# EAGLE design pixel-mk-1.0 (EAGLE 6.5.0)
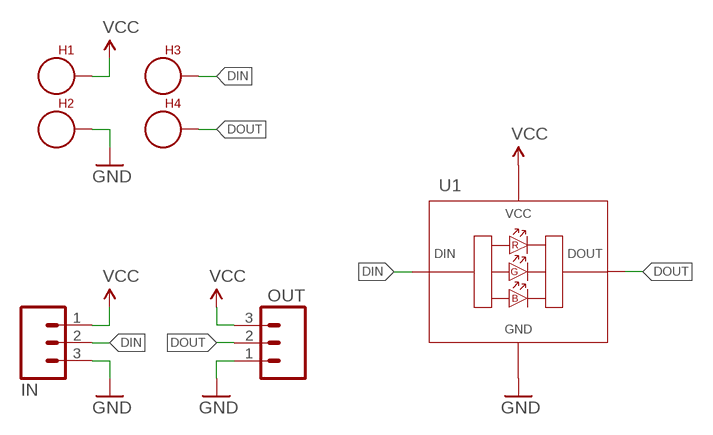
[diagram p0: schematic, sheet 1]

## Parts
H1  SEW_HOLE  [SIMPLE_HOLE]
H2  SEW_HOLE  [SIMPLE_HOLE]
H3  SEW_HOLE  [SIMPLE_HOLE]
H4  SEW_HOLE  [SIMPLE_HOLE]
IN  M03JST-PTH  [JST-3-PH-RA-PTH]
OUT  M03JST-PTH  [JST-3-PH-RA-PTH]
U1  NEOPIXEL5MM-PTH-RA-NS  [LED-5MM-PTH-FUCK-RA-NS]

## Nets
DIN: H3.P$1 IN.2 U1.1(DIN)
DOUT: H4.P$1 OUT.2 U1.4(DOUT)
GND: H2.P$1 IN.3 OUT.1 U1.3(GND)
VCC: H1.P$1 IN.1 OUT.3 U1.2(VCC)

## Library data of the parts
H1-H4 = A_butts:SEW_HOLE: Simple sew-hole .1" diameter hole with 20mil annular ring
IN OUT = A_butts:M03: Header 3 Standard 3-pin 0.1" header. Use with straight break away headers (SKU : PRT-00116), right angle break away headers (PRT-00553), swiss pins (PRT-00743), machine pins (PRT-00117), and female headers (PRT-00115). Molex polarized connector foot print use with SKU : PRT-08232 with associated crimp pins and housings.; SKU: PRT-09915
U1 = A_butts:NEOPIXEL

## Board
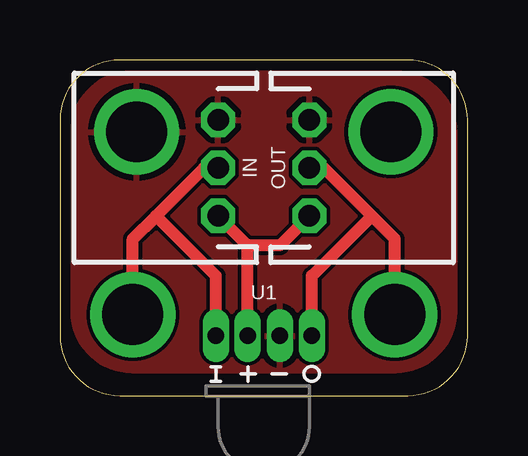
[diagram p1: board, top side]
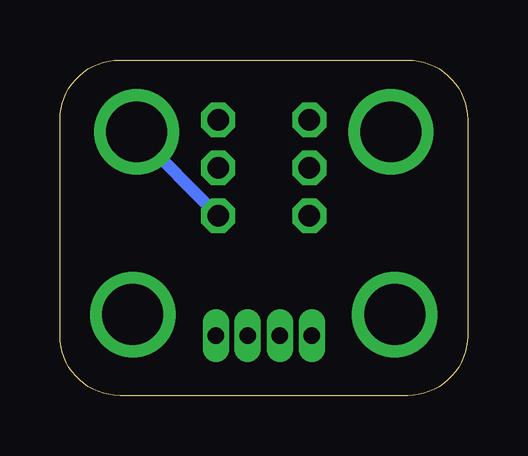
[diagram p2: board, bottom side, seen from below]

Size 17 x 14 mm. Coordinates in mm from the lower left corner, seen from the top.
Outline: 0,11.5 0,2.5 arc90 2.5,0 14.5,0 arc90 17,2.5 17,11.5 arc90 14.5,14 2.5,14 arc90 0,11.5
Copper layers (1*16): Top 0.0356mm / dielectric 1.5011mm / Bottom 0.0356mm
Design rules "LaenPCBOrder_2": minimum track width 6mil, minimum drill 13mil, track to track 6mil, track to pad 6mil, pad to pad 6mil, via to via 6mil, smd to smd 6mil, copper to edge 15mil, drill to drill 6mil, minimum pad ring 7mil, minimum via ring 7mil, stop-mask expansion 3mil, vias tented up to drill 20mil, thermal gap 10mil

### Footprints (pad centres in the part's own frame; a part is rotated, then mirrored left to right if it is on the bottom)
SIMPLE_HOLE = drill 2.54 pad 3.048: P$1 0,0
JST-3-PH-RA-PTH = drill 0.9 pad 1.422 octagon: 1 -2,0; 2 0,0; 3 2,0
LED-5MM-PTH-FUCK-RA-NS = drill 0.7 pad 1.1 long: 1 -2,0; 2 -0.667,0; 3 0.667,0; 4 2,0

### Placement (x,y rotation side)
H1  13.8,11 0 top
H2  3.2,11 0 top
H3  3.04,3.38 0 top
H4  13.96,3.38 0 top
IN  6.6,9.5 90 top
OUT  10.4,9.5 270 top
U1  8.5,2.5 0 top

### Tracks (layer width: path | path; a pad name or v marks a point on that pad's centre or on a via)
DIN
  Top 0.5: H3.P$1 3.04,6.54 4,7.5 | 4,7.5 6,9.5 IN.2 | U1.1 6.5,5 4,7.5
DOUT
  Top 0.5: H4.P$1 13.96,6.54 13,7.5 | 13,7.5 11,9.5 OUT.2 | U1.4 10.5,5 13,7.5
GND
  pour Top: 14,1 3,1 arc-90 0.5,3.5 0.5,11 arc-90 3,13.5 14,13.5 arc-90 16.5,11 16.5,3.5 arc-90
VCC
  Top 0.5: U1.2 7.83,6.27 | 7.83,6.27 IN.1 | OUT.3 9.17,6.27 7.83,6.27
  Bottom 0.5: H1.P$1 13.8,10.9 OUT.3